# EAGLE schematic MotorDriverModule (EAGLE 9.6.2)
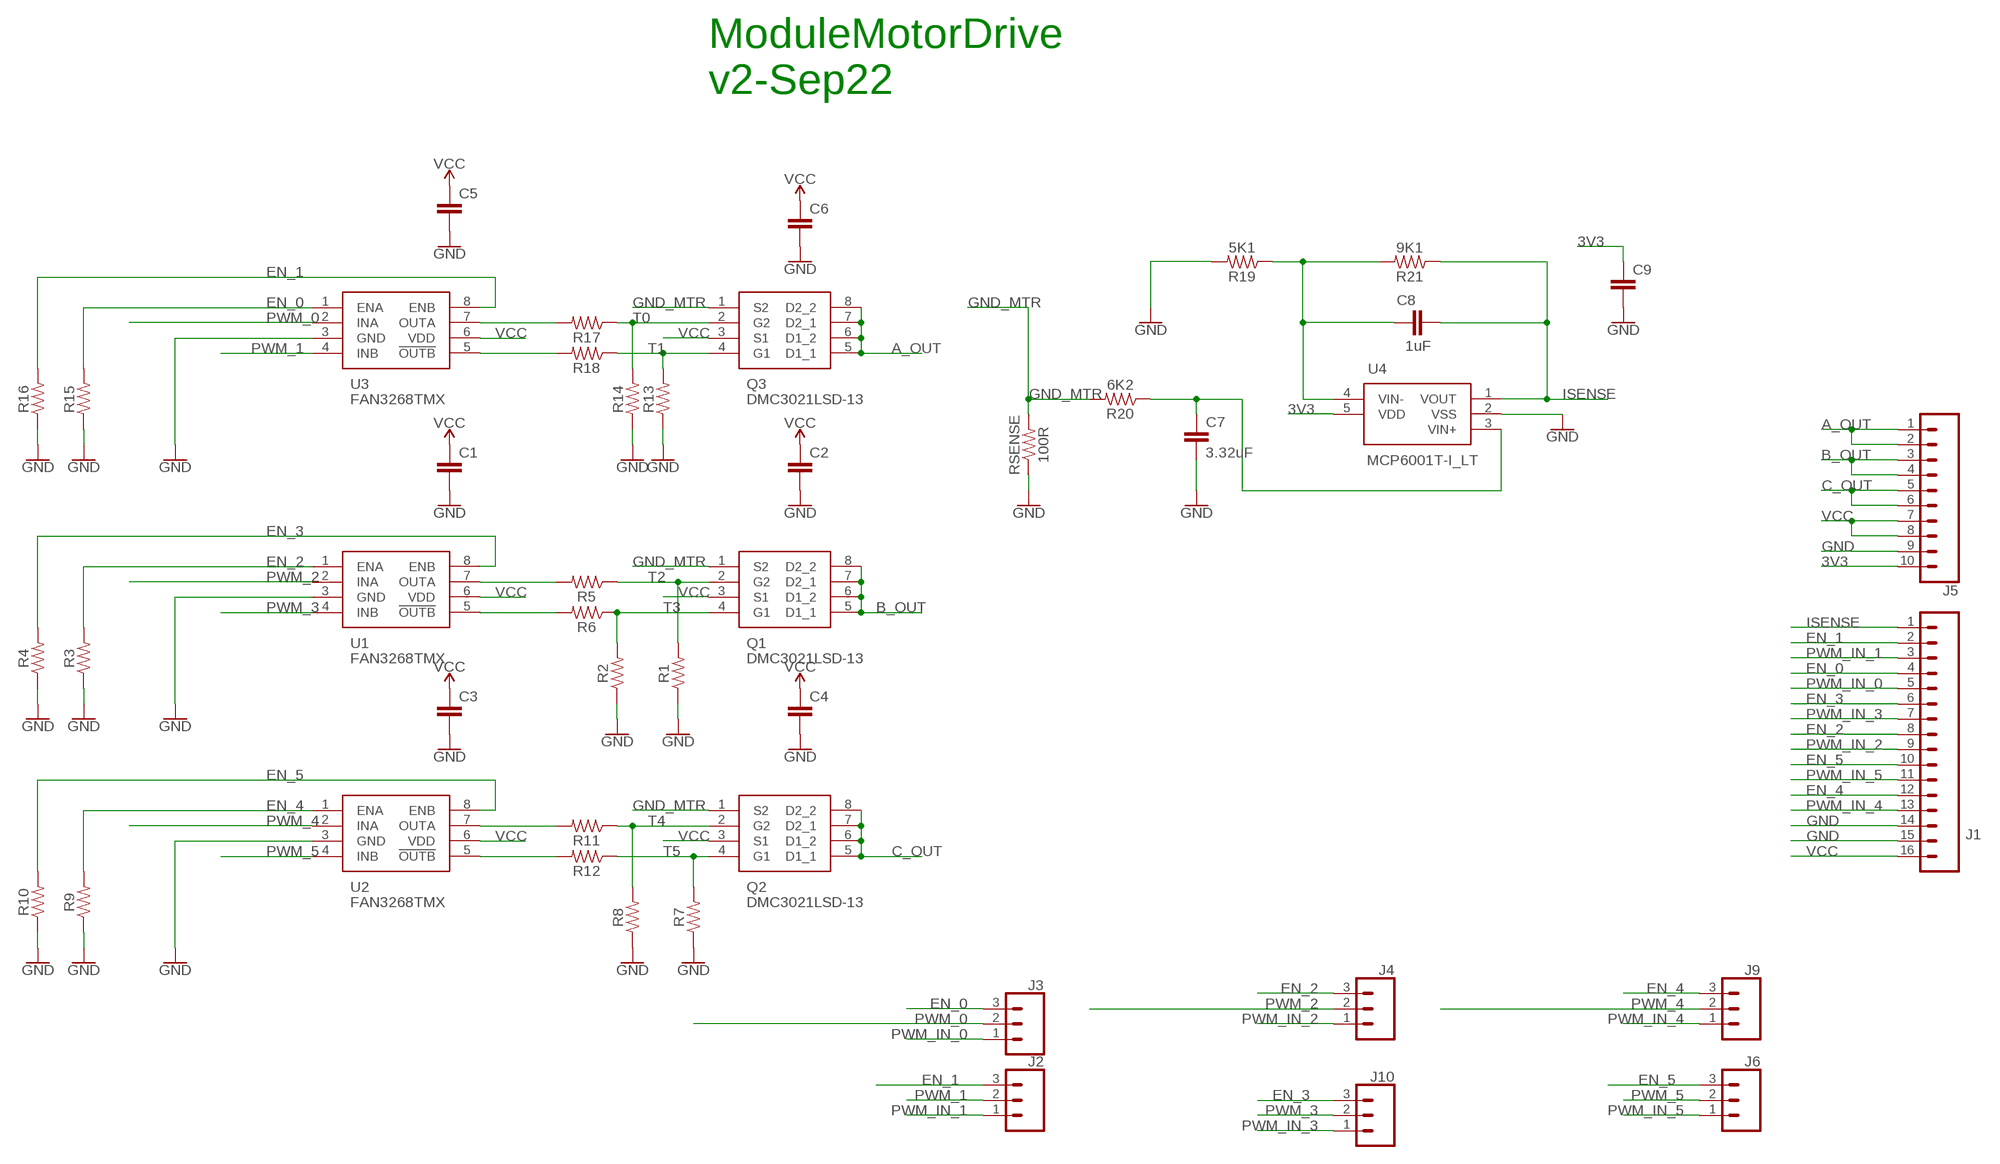
[diagram p0: schematic, sheet 1]

## Parts
C1  C-EUC0805  [C0805]
C2  C-EUC0805  [C0805]
C3  C-EUC0805  [C0805]
C4  C-EUC0805  [C0805]
C5  C-EUC0805  [C0805]
C6  C-EUC0805  [C0805]
C7  3.32uF  C-EUC0805  [C0805]
C8  1uF  C-EUC0805  [C0805]
C9  C-EUC0805  [C0805]
J1  CONN_16  [1X16]
J2  CONN_03  [1X03]
J3  CONN_03  [1X03]
J4  CONN_03  [1X03]
J5  CONN_10"  [1X10]
J6  CONN_03  [1X03]
J9  CONN_03  [1X03]
J10  CONN_03  [1X03]
Q1  DMC3021LSD-13  [SOIC127P600X175-8N]
Q2  DMC3021LSD-13  [SOIC127P600X175-8N]
Q3  DMC3021LSD-13  [SOIC127P600X175-8N]
R1  RESISTOR0805  [0805]
R2  RESISTOR0805  [0805]
R3  RESISTOR0805  [0805]
R4  RESISTOR0805  [0805]
R5  RESISTOR0805  [0805]
R6  RESISTOR0805  [0805]
R7  RESISTOR0805  [0805]
R8  RESISTOR0805  [0805]
R9  RESISTOR0805  [0805]
R10  RESISTOR0805  [0805]
R11  RESISTOR0805  [0805]
R12  RESISTOR0805  [0805]
R13  RESISTOR0805  [0805]
R14  RESISTOR0805  [0805]
R15  RESISTOR0805  [0805]
R16  RESISTOR0805  [0805]
R17  RESISTOR0805  [0805]
R18  RESISTOR0805  [0805]
R19  5K1  RESISTOR0805  [0805]
R20  6K2  RESISTOR0805  [0805]
R21  9K1  RESISTOR0805  [0805]
RSENSE  100R  RESISTOR1206  [1206]
U1  FAN3268TMX  [SOIC127P600X175-8N]
U2  FAN3268TMX  [SOIC127P600X175-8N]
U3  FAN3268TMX  [SOIC127P600X175-8N]
U4  MCP6001T-I_LT  [SOT65P210X110-5N]

## Nets
3V3: C9.1 J5.10 U4.5(VDD)
A_OUT: J5.1 J5.2 Q3.5(D1_1) Q3.6(D1_2) Q3.7(D2_1) Q3.8(D2_2)
B_OUT: J5.3 J5.4 Q1.5(D1_1) Q1.6(D1_2) Q1.7(D2_1) Q1.8(D2_2)
C_OUT: J5.5 J5.6 Q2.5(D1_1) Q2.6(D1_2) Q2.7(D2_1) Q2.8(D2_2)
EN_0: J1.4 J3.3 R15.2 U3.1(ENA)
EN_1: J1.2 J2.3 R16.2 U3.8(ENB)
EN_2: J1.8 J4.3 R3.2 U1.1(ENA)
EN_3: J1.6 J10.3 R4.2 U1.8(ENB)
EN_4: J1.12 J9.3 R9.2 U2.1(ENA)
EN_5: J1.10 J6.3 R10.2 U2.8(ENB)
GND: C1.2 C2.2 C3.2 C4.2 C5.2 C6.2 C7.2 C9.2 J1.14 J1.15 J5.9 R1.1 R2.1 R3.1 R4.1 R7.1 R8.1 R9.1 R10.1 R13.1 R14.1 R15.1 R16.1 R19.2 RSENSE.1 U1.3(GND) U2.3(GND) U3.3(GND) U4.2(VSS)
GND_MTR: Q1.1(S2) Q2.1(S2) Q3.1(S2) R20.2 RSENSE.2
ISENSE: C8.2 J1.1 R21.1 U4.1(VOUT)
N$2: C8.1 R19.1 R21.2 U4.4(VIN-)
N$3: C7.1 R20.1 U4.3(VIN+)
N$5: R6.2 U1.5(!OUTB)
N$6: R5.2 U1.7(OUTA)
N$14: R12.2 U2.5(!OUTB)
N$15: R11.2 U2.7(OUTA)
N$23: R18.2 U3.5(!OUTB)
N$24: R17.2 U3.7(OUTA)
PWM_0: J3.2 U3.2(INA)
PWM_1: J2.2 U3.4(INB)
PWM_2: J4.2 U1.2(INA)
PWM_3: J10.2 U1.4(INB)
PWM_4: J9.2 U2.2(INA)
PWM_5: J6.2 U2.4(INB)
PWM_IN_0: J1.5 J3.1
PWM_IN_1: J1.3 J2.1
PWM_IN_2: J1.9 J4.1
PWM_IN_3: J1.7 J10.1
PWM_IN_4: J1.13 J9.1
PWM_IN_5: J1.11 J6.1
T0: Q3.2(G2) R14.2 R17.1
T1: Q3.4(G1) R13.2 R18.1
T2: Q1.2(G2) R1.2 R5.1
T3: Q1.4(G1) R2.2 R6.1
T4: Q2.2(G2) R8.2 R11.1
T5: Q2.4(G1) R7.2 R12.1
VCC: C1.1 C2.1 C3.1 C4.1 C5.1 C6.1 J1.16 J5.7 J5.8 Q1.3(S1) Q2.3(S1) Q3.3(S1) U1.6(VDD) U2.6(VDD) U3.6(VDD)

## Notes on the sheet
- ModuleMotorDrive
  v2-Sep22

## Library data of the parts
C1-C9 = rcl:C-EU: CAPACITOR, European symbol; SPICEPREFIX: C
J1 = SparkFun-Connectors:CONN_16: Multi connection point. Often used as Generic Header-pin footprint for 0.1 inch spaced/style header connections On any of the 0.1 inch spaced packages, you can populate with these: Break Away Headers - Straight <https://www.sparkfun.com/products/116> (PRT-00116) Break Away Male Headers - Right Angle <https://www.sparkfun.com/products/553> (PRT-00553) Female Headers <https://www.sparkfun.com/products/115> (PRT-00115) Break Away Headers - Machine Pin <https://www.sparkfun.com/products/117> (PRT-00117) Break Away Female Headers - Swiss Machine Pin <https://www.sparkfun.com/products/743> (PRT-00743) For SCREWTERMINALS and SPRING TERMINALS visit here: Screw Terimnals on SparkFun.com <https://www.sparkfun.com/search/results?term=Screw+Terminals> (5mm/3.5mm/2.54mm spacing) This device is also useful as a general connection point to wire up your design to another part of your project. Our various solder wires solder well into these plated through hole pads. Hook-Up Wire - Assortment (Stranded, 22 AWG) <https://www.sparkfun.com/products/11375> (PRT-11375) Hook-Up Wire - Assortment (Solid Core, 22 AWG) <https://www.sparkfun.com/products/11367> (PRT-11367) View the entire wire category on our website here <https://www.sparkfun.com/categories/141> Special notes: Molex polarized connector foot print use with SKU : PRT-08231 with associated crimp pins and housings. 1MM SMD Version SKU: PRT-10208 NOTES ON THE VARIANTS LOCK and LOCK_LONGPADS... This footprint was designed to help hold the alignment of a through-hole component (i.e. 6-pin header) while soldering it into place. You may notice that each hole has been shifted either up or down by 0.005 of an inch from it's more standard position (which is a perfectly straight line). This slight alteration caused the pins (the squares in the middle) to touch the edges of the holes. Because they are alternating, it causes a "brace" to hold the component in place. 0.005 has proven to be the perfect amount of "off-center" position when using our standard breakaway headers. Although looks a little odd when you look at the bare footprint, once you have a header in there, the alteration is very hard to notice. Also,if you push a header all the way into place, it is covered up entirely on the bottom side.
J2-J4 J6 J9 J10 = SparkFun-Connectors:CONN_03: Multi connection point. Often used as Generic Header-pin footprint for 0.1 inch spaced/style header connections On any of the 0.1 inch spaced packages, you can populate with these: Break Away Headers - Straight <https://www.sparkfun.com/products/116> (PRT-00116) Break Away Male Headers - Right Angle <https://www.sparkfun.com/products/553> (PRT-00553) Female Headers <https://www.sparkfun.com/products/115> (PRT-00115) Break Away Headers - Machine Pin <https://www.sparkfun.com/products/117> (PRT-00117) Break Away Female Headers - Swiss Machine Pin <https://www.sparkfun.com/products/743> (PRT-00743) Stackable Header - 3 Pin (Female, 0.1") <https://www.sparkfun.com/products/13875> (PRT-13875) For SCREWTERMINALS and SPRING TERMINALS visit here: Screw Terimnals on SparkFun.com <https://www.sparkfun.com/search/results?term=Screw+Terminals> (5mm/3.5mm/2.54mm spacing) This device is also useful as a general connection point to wire up your design to another part of your project. Our various solder wires solder well into these plated through hole pads. Hook-Up Wire - Assortment (Stranded, 22 AWG) <https://www.sparkfun.com/products/11375> (PRT-11375) Hook-Up Wire - Assortment (Solid Core, 22 AWG) <https://www.sparkfun.com/products/11367> (PRT-11367) View the entire wire category on our website here <https://www.sparkfun.com/categories/141> Special notes: Molex polarized connector foot print use with SKU : PRT-08232 with associated crimp pins and housings.
J5 = SparkFun-Connectors:CONN_10: Multi connection point. Often used as Generic Header-pin footprint for 0.1 inch spaced/style header connections On any of the 0.1 inch spaced packages, you can populate with these: Break Away Headers - Straight <https://www.sparkfun.com/products/116> (PRT-00116) Break Away Male Headers - Right Angle <https://www.sparkfun.com/products/553> (PRT-00553) Female Headers <https://www.sparkfun.com/products/115> (PRT-00115) Break Away Headers - Machine Pin <https://www.sparkfun.com/products/117> (PRT-00117) Break Away Female Headers - Swiss Machine Pin <https://www.sparkfun.com/products/743> (PRT-00743) Arduino Stackable Header - 10 Pin <https://www.sparkfun.com/products/11376> (PRT-11376) For SCREWTERMINALS and SPRING TERMINALS visit here: Screw Terimnals on SparkFun.com <https://www.sparkfun.com/search/results?term=Screw+Terminals> (5mm/3.5mm/2.54mm spacing) This device is also useful as a general connection point to wire up your design to another part of your project. Our various solder wires solder well into these plated through hole pads. Hook-Up Wire - Assortment (Stranded, 22 AWG) <https://www.sparkfun.com/products/11375> (PRT-11375) Hook-Up Wire - Assortment (Solid Core, 22 AWG) <https://www.sparkfun.com/products/11367> (PRT-11367) View the entire wire category on our website here <https://www.sparkfun.com/categories/141> Special notes: Molex polarized connector foot print use with SKU : PRT-08231 with associated crimp pins and housings. 1MM SMD Version SKU: PRT-10208 NOTES ON THE VARIANTS LOCK and LOCK_LONGPADS... This footprint was designed to help hold the alignment of a through-hole component (i.e. 6-pin header) while soldering it into place. You may notice that each hole has been shifted either up or down by 0.005 of an inch from it's more standard position (which is a perfectly straight line). This slight alteration caused the pins (the squares in the middle) to touch the edges of the holes. Because they are alternating, it causes a "brace" to hold the component in place. 0.005 has proven to be the perfect amount of "off-center" position when using our standard breakaway headers. Although looks a little odd when you look at the bare footprint, once you have a header in there, the alteration is very hard to notice. Also,if you push a header all the way into place, it is covered up entirely on the bottom side.; PROD_ID: CONN-11563
Q1-Q3 = DMC3021LSD-13:DMC3021LSD-13: MOSFET Dual N/P-Channel 30V 8.5A/7A SO8 Diodes Inc DMC3021LSD-13 Dual N/P-channel MOSFET Transistor, 8-Pin SOIC Source: Datasheet <https://www.diodes.com/assets/Datasheets/ds32152.pdf>; DESCRIPTION: MOSFET Dual N/P-Channel 30V 8.5A/7A SO8 Diodes Inc DMC3021LSD-13 Dual N/P-channel MOSFET Transistor, 8-Pin SOIC; HEIGHT: 1.75mm; MANUFACTURER_NAME: Diodes Inc.; MANUFACTURER_PART_NUMBER: DMC3021LSD-13; MOUSER_PART_NUMBER: 621-DMC3021LSD-13; MOUSER_PRICE-STOCK: https://www.mouser.co.uk/ProductDetail/Diodes-Incorporated/DMC3021LSD-13?qs=WZYOKEqGBpLz0mDfwbjxxA%3D%3D
R1-R21 RSENSE = SparkFun-Resistors:RESISTOR: Generic Resistor Package
U1-U3 = FAN3268TMX:FAN3268TMX: FAN3268TMX Source: Datasheet; ARROW_PART_NUMBER: FAN3268TMX; ARROW_PRICE-STOCK: https://www.arrow.com/en/products/fan3268tmx/on-semiconductor; DESCRIPTION: FAN3268TMX; HEIGHT: 1.75mm; MANUFACTURER_NAME: onsemi; MANUFACTURER_PART_NUMBER: FAN3268TMX; MOUSER_PART_NUMBER: 512-FAN3268TMX; MOUSER_PRICE-STOCK: https://www.mouser.co.uk/ProductDetail/ON-Semiconductor-Fairchild/FAN3268TMX/?qs=cjOFguiotuKeCt2NyaHM9g%3D%3D
U4 = MCP6001T-I_LT:MCP6001T-I_LT: Microchip MCP6001T-I/LT Low Power Op Amp, 1MHz Rail-Rail, 1.8 6 V, 5-Pin SC-70 Source: Datasheet <http://componentsearchengine.com/Datasheets/3/MCP6001T-I_LT.pdf>; ARROW_PART_NUMBER: MCP6001T-I/LT; ARROW_PRICE-STOCK: https://www.arrow.com/en/products/mcp6001t-ilt/microchip-technology?region=nac; DESCRIPTION: Microchip MCP6001T-I/LT Low Power Op Amp, 1MHz Rail-Rail, 1.8 6 V, 5-Pin SC-70; HEIGHT: 1.1mm; MANUFACTURER_NAME: Microchip; MANUFACTURER_PART_NUMBER: MCP6001T-I/LT; MOUSER_PART_NUMBER: 579-MCP6001T-I/LT; MOUSER_PRICE-STOCK: https://www.mouser.co.uk/ProductDetail/Microchip-Technology-Atmel/MCP6001T-I-LT?qs=Q%2Fw7XRh99il03y7Zr5Ze0Q%3D%3D